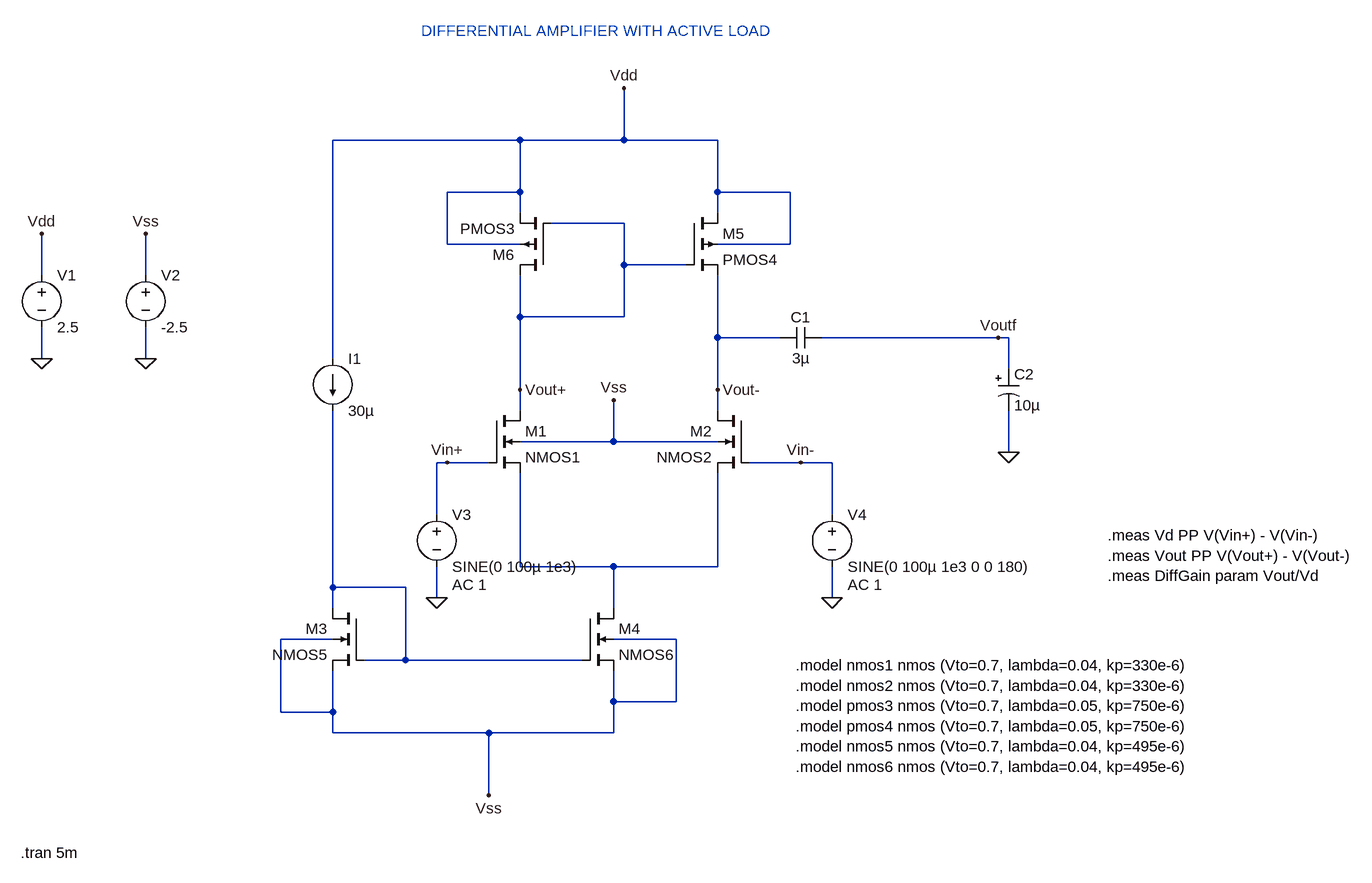
[diagram p0: schematic DIFFERENTIAL AMPLIFIER WITH ACTIVE LOAD.asc]
DIFFERENTIAL AMPLIFIER WITH ACTIVE LOAD.asc, the LTspice schematic file:
Version 4
SHEET 1 1904 856
WIRE 592 -256 304 -256
WIRE 752 -256 752 -336
WIRE 752 -256 592 -256
WIRE 896 -256 752 -256
WIRE 592 -176 592 -256
WIRE 592 -176 480 -176
WIRE 896 -176 896 -256
WIRE 1008 -176 896 -176
WIRE 592 -144 592 -176
WIRE 896 -144 896 -176
WIRE 752 -128 640 -128
WIRE 480 -96 480 -176
WIRE 592 -96 480 -96
WIRE 1008 -96 1008 -176
WIRE 1008 -96 896 -96
WIRE 752 -64 752 -128
WIRE 848 -64 752 -64
WIRE -144 -48 -144 -112
WIRE 16 -48 16 -112
WIRE 592 16 592 -48
WIRE 752 16 752 -64
WIRE 752 16 592 16
WIRE 896 48 896 -48
WIRE 992 48 896 48
WIRE 1328 48 1056 48
WIRE 1344 48 1328 48
WIRE -144 80 -144 32
WIRE 16 80 16 32
WIRE 304 80 304 -256
WIRE 1344 96 1344 48
WIRE 592 128 592 16
WIRE 896 128 896 48
WIRE 592 160 592 128
WIRE 896 160 896 128
WIRE 736 208 736 144
WIRE 736 208 592 208
WIRE 896 208 736 208
WIRE 1344 224 1344 160
WIRE 480 240 464 240
WIRE 544 240 480 240
WIRE 1024 240 944 240
WIRE 1072 240 1024 240
WIRE 464 320 464 240
WIRE 1072 320 1072 240
WIRE 592 400 592 256
WIRE 736 400 592 400
WIRE 896 400 896 256
WIRE 896 400 736 400
WIRE 304 432 304 160
WIRE 416 432 304 432
WIRE 464 448 464 400
WIRE 1072 448 1072 400
WIRE 304 464 304 432
WIRE 736 464 736 400
WIRE 304 512 224 512
WIRE 832 512 736 512
WIRE 416 544 416 432
WIRE 416 544 352 544
WIRE 688 544 416 544
WIRE 736 608 736 560
WIRE 832 608 832 512
WIRE 832 608 736 608
WIRE 224 624 224 512
WIRE 304 624 304 560
WIRE 304 624 224 624
WIRE 304 656 304 624
WIRE 544 656 304 656
WIRE 736 656 736 608
WIRE 736 656 544 656
WIRE 544 752 544 656
FLAG -144 80 0
FLAG 16 80 0
FLAG -144 -112 Vdd
FLAG 16 -112 Vss
FLAG 544 752 Vss
FLAG 752 -336 Vdd
FLAG 736 144 Vss
FLAG 464 448 0
FLAG 1072 448 0
FLAG 1344 224 0
FLAG 480 240 Vin+
FLAG 1024 240 Vin-
FLAG 592 128 Vout+
FLAG 896 128 Vout-
FLAG 1328 48 Voutf
SYMBOL voltage -144 -64 R0
WINDOW 123 0 0 Left 0
WINDOW 39 0 0 Left 0
SYMATTR InstName V1
SYMATTR Value 2.5
SYMBOL voltage 16 -64 R0
WINDOW 123 0 0 Left 0
WINDOW 39 0 0 Left 0
SYMATTR InstName V2
SYMATTR Value -2.5
SYMBOL nmos4 544 160 R0
SYMATTR InstName M1
SYMATTR Value NMOS1
SYMBOL nmos4 944 160 M0
SYMATTR InstName M2
SYMATTR Value NMOS2
SYMBOL nmos4 352 464 M0
SYMATTR InstName M3
SYMATTR Value NMOS5
SYMBOL nmos4 688 464 R0
SYMATTR InstName M4
SYMATTR Value NMOS6
SYMBOL pmos4 848 -144 R0
SYMATTR InstName M5
SYMATTR Value PMOS4
SYMBOL pmos4 640 -48 R180
SYMATTR InstName M6
SYMATTR Value PMOS3
SYMBOL current 304 80 R0
WINDOW 123 0 0 Left 0
WINDOW 39 0 0 Left 0
SYMATTR InstName I1
SYMATTR Value 30µ
SYMBOL voltage 464 304 R0
WINDOW 123 24 124 Left 2
WINDOW 39 0 0 Left 0
SYMATTR Value2 AC 1
SYMATTR InstName V3
SYMATTR Value SINE(0 100µ 1e3)
SYMBOL voltage 1072 304 R0
WINDOW 123 24 124 Left 2
WINDOW 39 0 0 Left 0
SYMATTR Value2 AC 1
SYMATTR InstName V4
SYMATTR Value SINE(0 100µ 1e3 0 0 180)
SYMBOL cap 1056 32 R90
WINDOW 0 0 32 VBottom 2
WINDOW 3 32 32 VTop 2
SYMATTR InstName C1
SYMATTR Value 3µ
SYMBOL polcap 1328 96 R0
SYMATTR InstName C2
SYMATTR Value 10µ
SYMATTR Description Capacitor
SYMATTR Type cap
SYMATTR SpiceLine V=16 Irms=2.44949 Rser=0.045 Lser=0 mfg="KEMET" pn="A700V106M016ATE045" type="Al electrolytic"
TEXT 1016 552 Left 2 !.model nmos1 nmos (Vto=0.7, lambda=0.04, kp=330e-6)\n.model nmos2 nmos (Vto=0.7, lambda=0.04, kp=330e-6)\n.model pmos3 nmos (Vto=0.7, lambda=0.05, kp=750e-6)\n.model pmos4 nmos (Vto=0.7, lambda=0.05, kp=750e-6)\n.model nmos5 nmos (Vto=0.7, lambda=0.04, kp=495e-6)\n.model nmos6 nmos (Vto=0.7, lambda=0.04, kp=495e-6)
TEXT 440 -424 Left 2 ;DIFFERENTIAL AMPLIFIER WITH ACTIVE LOAD
TEXT 1496 352 Left 2 !.meas Vd PP V(Vin+) - V(Vin-)\n.meas Vout PP V(Vout+) - V(Vout-)\n.meas DiffGain param Vout/Vd
TEXT -176 840 Left 2 !.tran 5m

The netlist it stands for:
* DIFFERENTIAL AMPLIFIER WITH ACTIVE LOAD.asc
V1 Vdd 0 2.5
V2 Vss 0 -2.5
M1 Vout+ Vin+ N001 Vss NMOS1
M2 Vout- Vin- N001 Vss NMOS2
M3 N002 N002 Vss Vss NMOS5
M4 N001 N002 Vss Vss NMOS6
M5 Vdd Vout+ Vout- Vdd PMOS4
M6 Vout+ Vout+ Vdd Vdd PMOS3
I1 Vdd N002 30µ
V3 Vin+ 0 SINE(0 100µ 1e3) AC 1
V4 Vin- 0 SINE(0 100µ 1e3 0 0 180) AC 1
C1 Voutf Vout- 3µ
C2 Voutf 0 10µ V=16 Irms=2.44949 Rser=0.045 Lser=0 mfg="KEMET" pn="A700V106M016ATE045" type="Al electrolytic"
.model NMOS NMOS
.model PMOS PMOS
.lib standard.mos
.model nmos1 nmos (Vto=0.7, lambda=0.04, kp=330e-6)
.model nmos2 nmos (Vto=0.7, lambda=0.04, kp=330e-6)
.model pmos3 nmos (Vto=0.7, lambda=0.05, kp=750e-6)
.model pmos4 nmos (Vto=0.7, lambda=0.05, kp=750e-6)
.model nmos5 nmos (Vto=0.7, lambda=0.04, kp=495e-6)
.model nmos6 nmos (Vto=0.7, lambda=0.04, kp=495e-6)
* DIFFERENTIAL AMPLIFIER WITH ACTIVE LOAD
.meas Vd PP V(Vin+) - V(Vin-)
.meas Vout PP V(Vout+) - V(Vout-)
.meas DiffGain param Vout/Vd
.tran 5m
.backanno
.end